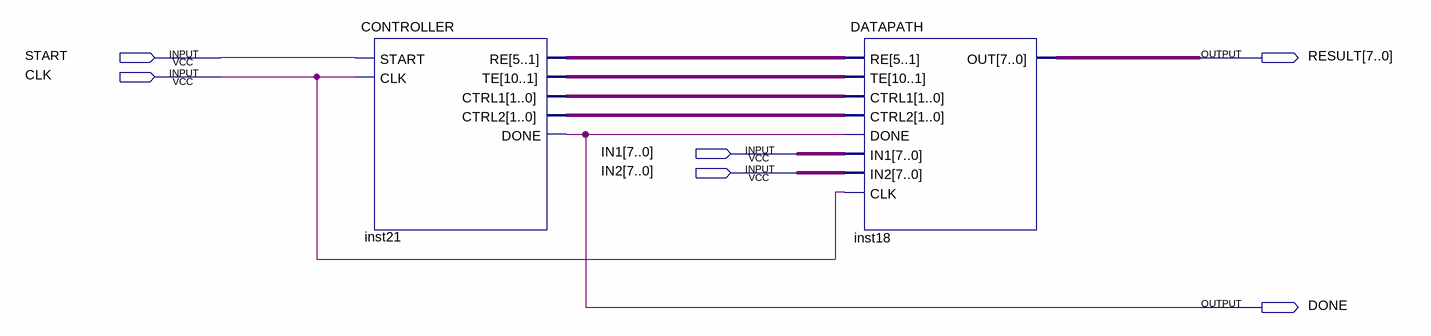
[diagram p0: schematic sheet]
// Quartus schematic DatapathPipelining.bdf as structural Verilog: 2 symbols, 6 pins
module DatapathPipelining (
  input  START,
  input  CLK,
  input  [7:0] IN1,
  input  [7:0] IN2,
  output [7:0] RESULT,
  output DONE
);

  wire [1:0] inst21_ctrl1, inst21_ctrl2;
  wire [4:0] inst21_re;
  wire [9:0] inst21_te;

  CONTROLLER inst21 (
    .START(START), .CLK(CLK), .RE(inst21_re), .TE(inst21_te), .CTRL1(inst21_ctrl1), .CTRL2(inst21_ctrl2),
    .DONE(DONE));
  DATAPATH inst18 (
    .CTRL1(inst21_ctrl1), .CTRL2(inst21_ctrl2), .IN1(IN1), .IN2(IN2), .RE(inst21_re), .TE(inst21_te),
    .CLK(CLK), .DONE(DONE), .OUT(RESULT));
endmodule
